# EAGLE design inclinometer-breakout-SCA100T (EAGLE 6.6.0)
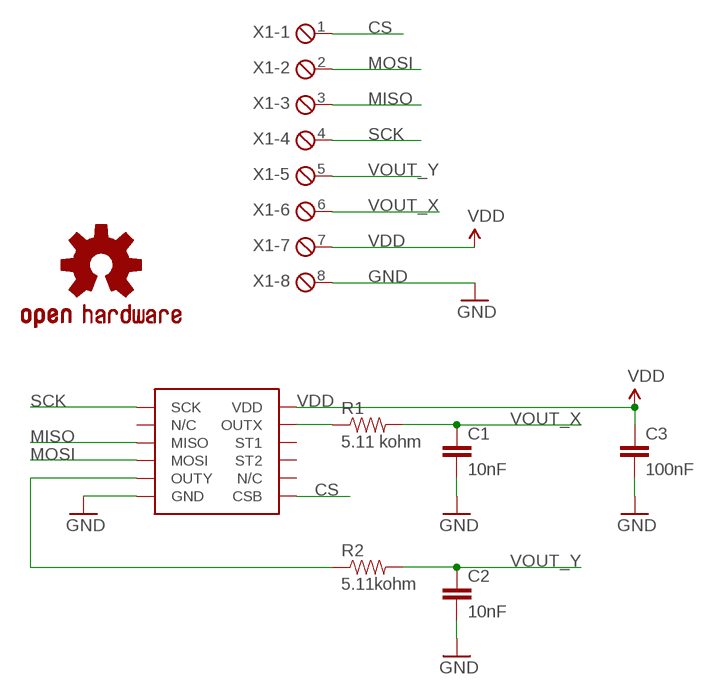
[diagram p0: schematic, sheet 1]

## Parts
C1  10nF  CAP0603-CAP  [0603-CAP]
C2  10nF  CAP0603-CAP  [0603-CAP]
C3  100nF  CAP0603-CAP  [0603-CAP]
LOGO1  OSHW-LOGOM  [OSHW-LOGO-M]
R1  5.11 kohm  RESISTOR0603-RES  [0603-RES]
R2  5.11kohm  RESISTOR0603-RES  [0603-RES]
U$1  SCA100T  SCA1000  [SCA1000]
X1  MPT8  [8POL254]

## Nets
CS: U$1.7(CSB) X1.1
GND: C1.2 C2.2 C3.2 U$1.6(GND) X1.8
MISO: U$1.3(MISO) X1.3
MOSI: U$1.4(MOSI) X1.2
N$1: R1.1 U$1.11(OUTX)
N$2: R2.1 U$1.5(OUTY)
SCK: U$1.1(SCK) X1.4
VDD: C3.1 U$1.12(VDD) X1.7
VOUT_X: C1.1 R1.2 X1.6
VOUT_Y: C2.1 R2.2 X1.5
Unconnected: U$1.2(N/C) U$1.8(N/C) U$1.9(ST2) U$1.10(ST1)

## Library data of the parts
C1-C3 = SparkFun-Passives:CAP: Capacitor Standard 0603 ceramic capacitor, and 0.1" leaded capacitor.
LOGO1 = SparkFun-Aesthetics:OSHW-LOGO: Open Source Hardware Logo This logo indicates the piece of hardware it is found on incorporates a OSHW license and/or adheres to the definition of open source hardware found here: http://freedomdefined.org/OSHW
R1 R2 = SparkFun-Passives:RESISTOR: Resistor Basic schematic elements and footprints for 0603, 1206, and PTH resistors.
U$1 = SparkFun-Sensors:SCA1000: Dual 4g accelerometer, SPI and analog out
X1 = con-phoenix-254:MPT8: PHOENIX CONNECTOR; OC_FARNELL: unknown; OC_NEWARK: unknown

## Board
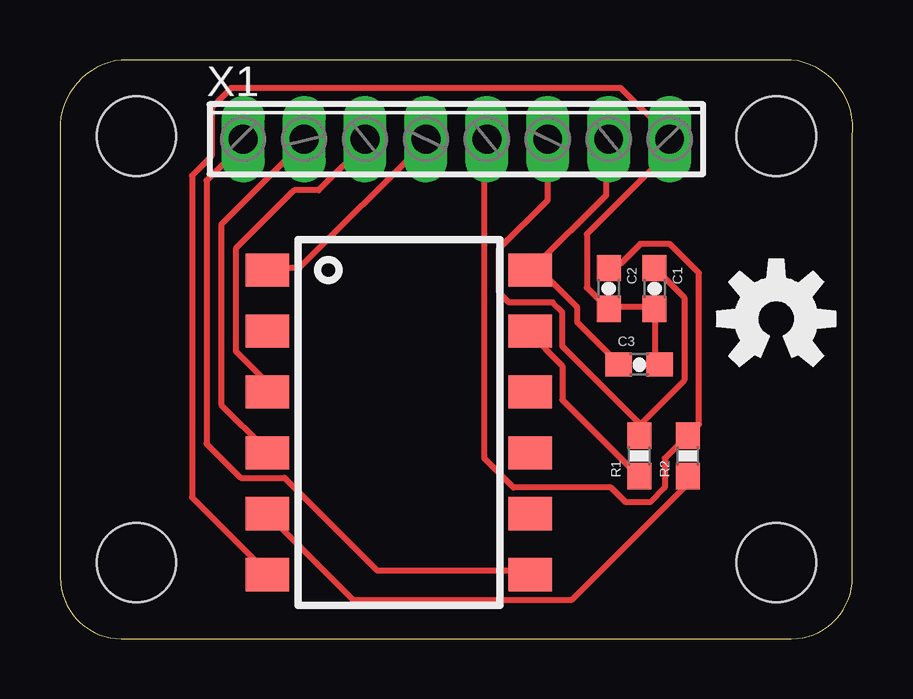
[diagram p1: board, top side]

Size 33.05 x 24.13 mm. Coordinates in mm from the lower left corner, seen from the top.
Outline: 2.56,0 30.5,0 arc90 33.04,2.54 33.04,20.95 arc90 30.5,24.13 2.56,24.13 arc90 0.02,20.95 0.02,2.54 arc90 2.56,0
Copper layers (1*16): Top 0.035mm / dielectric 1.5mm / Bottom 0.035mm
Design rules "default": minimum track width 10mil, minimum drill 24mil, track to track 8mil, track to pad 8mil, pad to pad 8mil, via to via 8mil, smd to smd 8mil, copper to edge 40mil, drill to drill 8mil, minimum pad ring 10mil, minimum via ring 8mil, stop-mask expansion 4mil, vias tented up to drill 0mil, thermal gap 10mil

### Footprints (pad centres in the part's own frame; a part is rotated, then mirrored left to right if it is on the bottom)
0603-CAP = smd 1.1 x 1: 1 -0.85,0; 2 0.85,0
STAND-OFF = hole 3.302: 0,0
0603-RES = smd 1.1 x 1: 1 -0.85,0; 2 0.85,0
SCA1000 = smd 1.81 x 1.39: 1 0,0; 2 0,-2.54; 3 0,-5.08; 4 0,-7.62; 5 0,-10.16; 6 0,-12.7; 7 10.96,-12.7; 8 10.96,-10.16; 9 10.96,-7.62; 10 10.96,-5.08; 11 10.96,-2.54; 12 10.96,0
8POL254 = drill 1.2 long: 1 -8.89,0; 2 -6.35,0; 3 -3.81,0; 4 -1.27,0; 5 1.27,0; 6 3.81,0; 7 6.35,0; 8 8.89,0

### Placement (x,y rotation side)
C1  24.78,14.61 270 top
C2  22.88,14.61 270 top
C3  24.15,11.43 0 top
JP1  STAND-OFF  [STAND-OFF]  3.19,3.17 0 top
JP2  STAND-OFF  [STAND-OFF]  3.19,20.95 0 top
JP3  STAND-OFF  [STAND-OFF]  29.86,20.95 0 top
JP4  STAND-OFF  [STAND-OFF]  29.86,3.17 0 top
LOGO1  29.86,13.34 0 top
R1  24.15,7.62 90 top
R2  26.18,7.62 90 top
U$1  8.65,15.37 0 top
X1  16.53,20.83 0 top

### Tracks (layer width: path | path; a pad name or v marks a point on that pad's centre or on a via)
CS
  Top 0.254: U$1.7 19.52,2.85 13.23,2.85 9.36,6.71 7.54,6.71 6.11,8.13 6.11,19.1 7.74,20.73 X1.1
GND
  Top 0.254: C3.2 24.81,11.58 24.81,13.61 C1.2 24.6,13.82 22.98,13.82 C2.2 22.78,13.82 21.96,14.63 21.96,16.87 25.42,20.32 X1.8 25.42,20.93 23.39,22.96 7.13,22.96 6.32,22.15 6.32,20.12 5.5,19.3 5.5,5.89 8.55,2.85 U$1.6
MISO
  Top 0.254: U$1.3 8.55,10.36 8.55,10.77 7.33,11.99 7.33,16.26 9.77,18.69 10.79,18.69 12.82,20.73 X1.3
MOSI
  Top 0.254: U$1.4 8.55,7.92 6.72,9.75 6.72,17.27 10.18,20.73 X1.2
N$1
  Top 0.254: R1.1 24,6.91 20.95,9.96 20.95,11.38 19.52,12.8 U$1.11
N$2
  Top 0.254: R2.1 26.03,6.71 26.03,6.3 21.35,1.63 12.21,1.63 8.76,5.08 U$1.5
SCK
  Top 0.254: U$1.1 8.76,15.44 9.97,15.44 15.26,20.73 X1.4
VDD
  Top 0.254: C3.1 23.18,11.58 21.56,13.21 21.56,13.82 20.13,15.24 19.73,15.24 U$1.12 19.73,15.44 22.78,18.49 22.78,20.73 X1.7
VOUT_X
  Top 0.254: 24.2,8.94 24.2,8.53 R1.2 24.2,8.94 | 24.2,8.94 26.03,10.77 26.03,14.22 24.81,15.44 C1.1 | X1.6 20.34,18.29 18.31,16.26 18.31,14.43 18.71,14.02 20.54,14.02 20.95,13.61 20.95,12.19 24.2,8.94
VOUT_Y
  Top 0.254: C2.1 22.98,15.65 23.39,15.65 24.2,16.46 25.42,16.46 26.64,15.24 26.64,8.94 26.23,8.53 R2.2 26.03,8.33 25.21,7.52 25.21,6.3 24.6,5.69 23.59,5.69 22.98,6.3 18.92,6.3 17.7,7.52 17.7,20.73 X1.5